# EAGLE design EStop_grn_term (EAGLE 9.6.2)
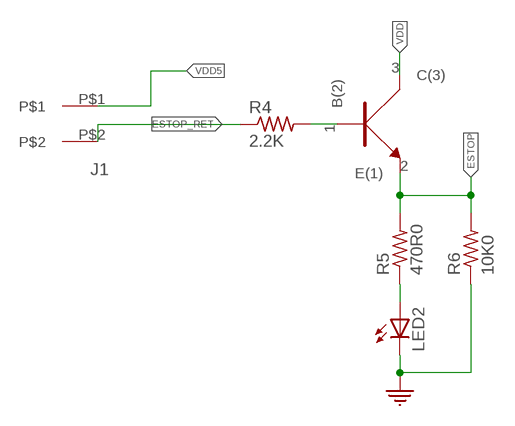
[diagram p0: schematic, sheet 1]

## Parts
J1  2-pos  3.81MM_1_X_2_RT_ANGLE_PLUG_HEADER  [2_3.81MM_PITCH]
LED2  Green  LED_0805_GREEN  [0805]
R4  2.2K  R_0402  [0402]
R5  470R0  R_0402_470R0  [0402]
R6  10K0  R_0402_10K0  [0402]
U2  NPN  BC846BW  [SOT323]

## Nets
ESTOP: R5.P$2 R6.P$2 U2.2(E(1))
ESTOP_RET: J1.P$2 R4.P$1
GND: LED2.2(C) R6.P$1
N$3: R4.P$2 U2.1(B(2))
N$4: LED2.1(A) R5.P$1
VDD: U2.3(C(3))
VDD5: J1.P$1

## Library data of the parts
J1 = 3D_MIG_Controller:3.81MM_1_X_2_RT_ANGLE_PLUG_HEADER: TERM BLOCK HDR 2POS 90DEG 3.81MM; PARTNO: 691322310002
LED2 = 3D_MIG_Controller:LED_0805_GREEN: Green 570nm LED Indication - Discrete 2.2V 0805 (2012 Metric); PARTNO: LG R971-KN-1
R4 = 3D_MIG_Controller:R_0402
R5 = 3D_MIG_Controller:R_0402_470R0; PARTNO: RMCF0402JT470R
R6 = 3D_MIG_Controller:R_0402_10K0; PARTNO: RMCF0402JT10K0
U2 = 3D_MIG_Controller:BC846BW: Bipolar (BJT) Transistor NPN 100MHz Surface Mount SOT-323; PARTNO: BC846BW_NPN

## Board
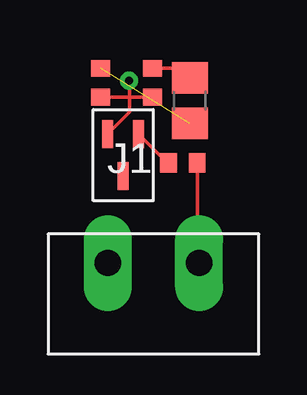
[diagram p1: board, top side]

No outline drawn. Coordinates in mm, seen from the top.
Copper layers (1*16): Top 0.035mm / dielectric 1.5mm / Bottom 0.035mm
Design rules "default": minimum track width 6mil, minimum drill 0.35mm, track to track 6mil, track to pad 6mil, pad to pad 6mil, via to via 6mil, smd to smd 6mil, copper to edge 40mil, drill to drill 6mil, minimum pad ring 10mil, minimum via ring 8mil, stop-mask expansion 4mil, vias tented up to drill 0mil, thermal gap 10mil

### Footprints (pad centres in the part's own frame; a part is rotated, then mirrored left to right if it is on the bottom)
2_3.81MM_PITCH = drill 1.1 pad 2 long: P$1 0,0; P$2 3.81,0
0805 = smd 1.3 x 1.5: 1 -0.95,0; 2 0.95,0
0402 = smd 0.8 x 0.7: P$1 0,0.6; P$2 0,-0.6
SOT323 = smd 0.457 x 1.168: 1 -0.65,-0.876; 2 0.65,-0.876; 3 0,0.876

### Placement (x,y rotation side)
J1  0,0 0 top
LED2  3.42,6.77 270 top
R4  3.13,4.18 270 top
R5  1.87,7.52 0 top
R6  -0.3,7.52 0 top
U2  0.64,4.5 180 top

### Tracks (layer width: path | path; a pad name or v marks a point on that pad's centre or on a via)
ESTOP  (via drill 0.35)
  Top 0.152: R6.P$2 0.9,6.92 | R5.P$2 0.9,6.92 | U2.2 0.9,6.29 0.9,6.92 | 0.9,6.92 v0.9,7.61 v0.89,7.61
ESTOP_RET
  Top 0.152: 3.63,4.08 R4.P$1 3.73,0.08 J1.P$2
GND  (1 unrouted)
N$3
  Top 0.152: U2.1 2.48,4.19 R4.P$2
N$4
  Top 0.152: LED2.1 3.02,8.12 R5.P$1